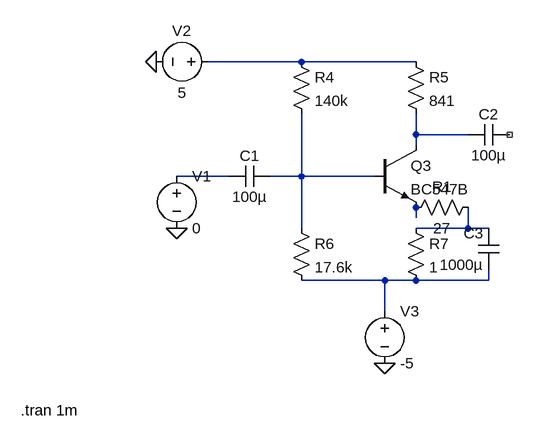
[diagram p0: schematic gain.asc]
gain.asc, the LTspice schematic file:
Version 4
SHEET 1 1176 680
WIRE 592 96 448 96
WIRE 768 96 592 96
WIRE 768 208 768 176
WIRE 848 208 768 208
WIRE 768 224 768 208
WIRE 480 272 400 272
WIRE 592 272 592 176
WIRE 592 272 544 272
WIRE 704 272 592 272
WIRE 768 336 768 320
WIRE 592 352 592 272
WIRE 848 352 848 320
WIRE 848 352 768 352
WIRE 880 352 848 352
WIRE 720 432 592 432
WIRE 768 432 720 432
WIRE 880 432 880 416
WIRE 880 432 768 432
WIRE 720 480 720 432
FLAG 400 352 0
FLAG 368 96 0
FLAG 720 560 0
SYMBOL res 576 80 R0
SYMATTR InstName R4
SYMATTR Value 140k
SYMBOL res 752 80 R0
SYMATTR InstName R5
SYMATTR Value 841
SYMBOL res 576 336 R0
SYMATTR InstName R6
SYMATTR Value 17.6k
SYMBOL res 752 336 R0
SYMATTR InstName R7
SYMATTR Value 1
SYMBOL npn 704 224 R0
SYMATTR InstName Q3
SYMATTR Value BC547B
SYMBOL cap 896 416 R180
WINDOW 0 24 56 Left 2
WINDOW 3 24 8 Left 2
SYMATTR InstName C3
SYMATTR Value 1000µ
SYMBOL voltage 400 256 R0
WINDOW 123 24 124 Left 2
WINDOW 39 0 0 Left 0
SYMATTR InstName V1
SYMATTR Value 0
SYMBOL voltage 464 96 R90
WINDOW 0 -32 56 VBottom 2
WINDOW 3 32 56 VTop 2
WINDOW 123 0 0 Left 0
WINDOW 39 0 0 Left 0
SYMATTR InstName V2
SYMATTR Value 5
SYMBOL voltage 720 464 R0
WINDOW 123 0 0 Left 0
WINDOW 39 0 0 Left 0
SYMATTR InstName V3
SYMATTR Value -5
SYMBOL res 864 304 R90
WINDOW 0 0 56 VBottom 2
WINDOW 3 32 56 VTop 2
SYMATTR InstName R1
SYMATTR Value 27
SYMBOL cap 544 256 R90
WINDOW 0 0 32 VBottom 2
WINDOW 3 32 32 VTop 2
SYMATTR InstName C1
SYMATTR Value 100µ
SYMBOL cap 912 192 R90
WINDOW 0 0 32 VBottom 2
WINDOW 3 32 32 VTop 2
SYMATTR InstName C2
SYMATTR Value 100µ
TEXT 160 632 Left 2 !.tran 1m

The netlist it stands for:
* gain.asc
R4 N001 N004 140k
R5 N001 N002 841
R6 N004 N007 17.6k
R7 N006 N007 1
Q3 N002 N004 N005 0 BC547B
C3 N007 N006 1000µ
V1 N003 0 0
V2 N001 0 5
V3 N007 0 -5
R1 N006 N005 27
C1 N004 N003 100µ
C2 NC_01 N002 100µ
.model NPN NPN
.model PNP PNP
.lib standard.bjt
.tran 1m
.backanno
.end